# EAGLE design RdL_main_v04 (EAGLE 7.6.0)
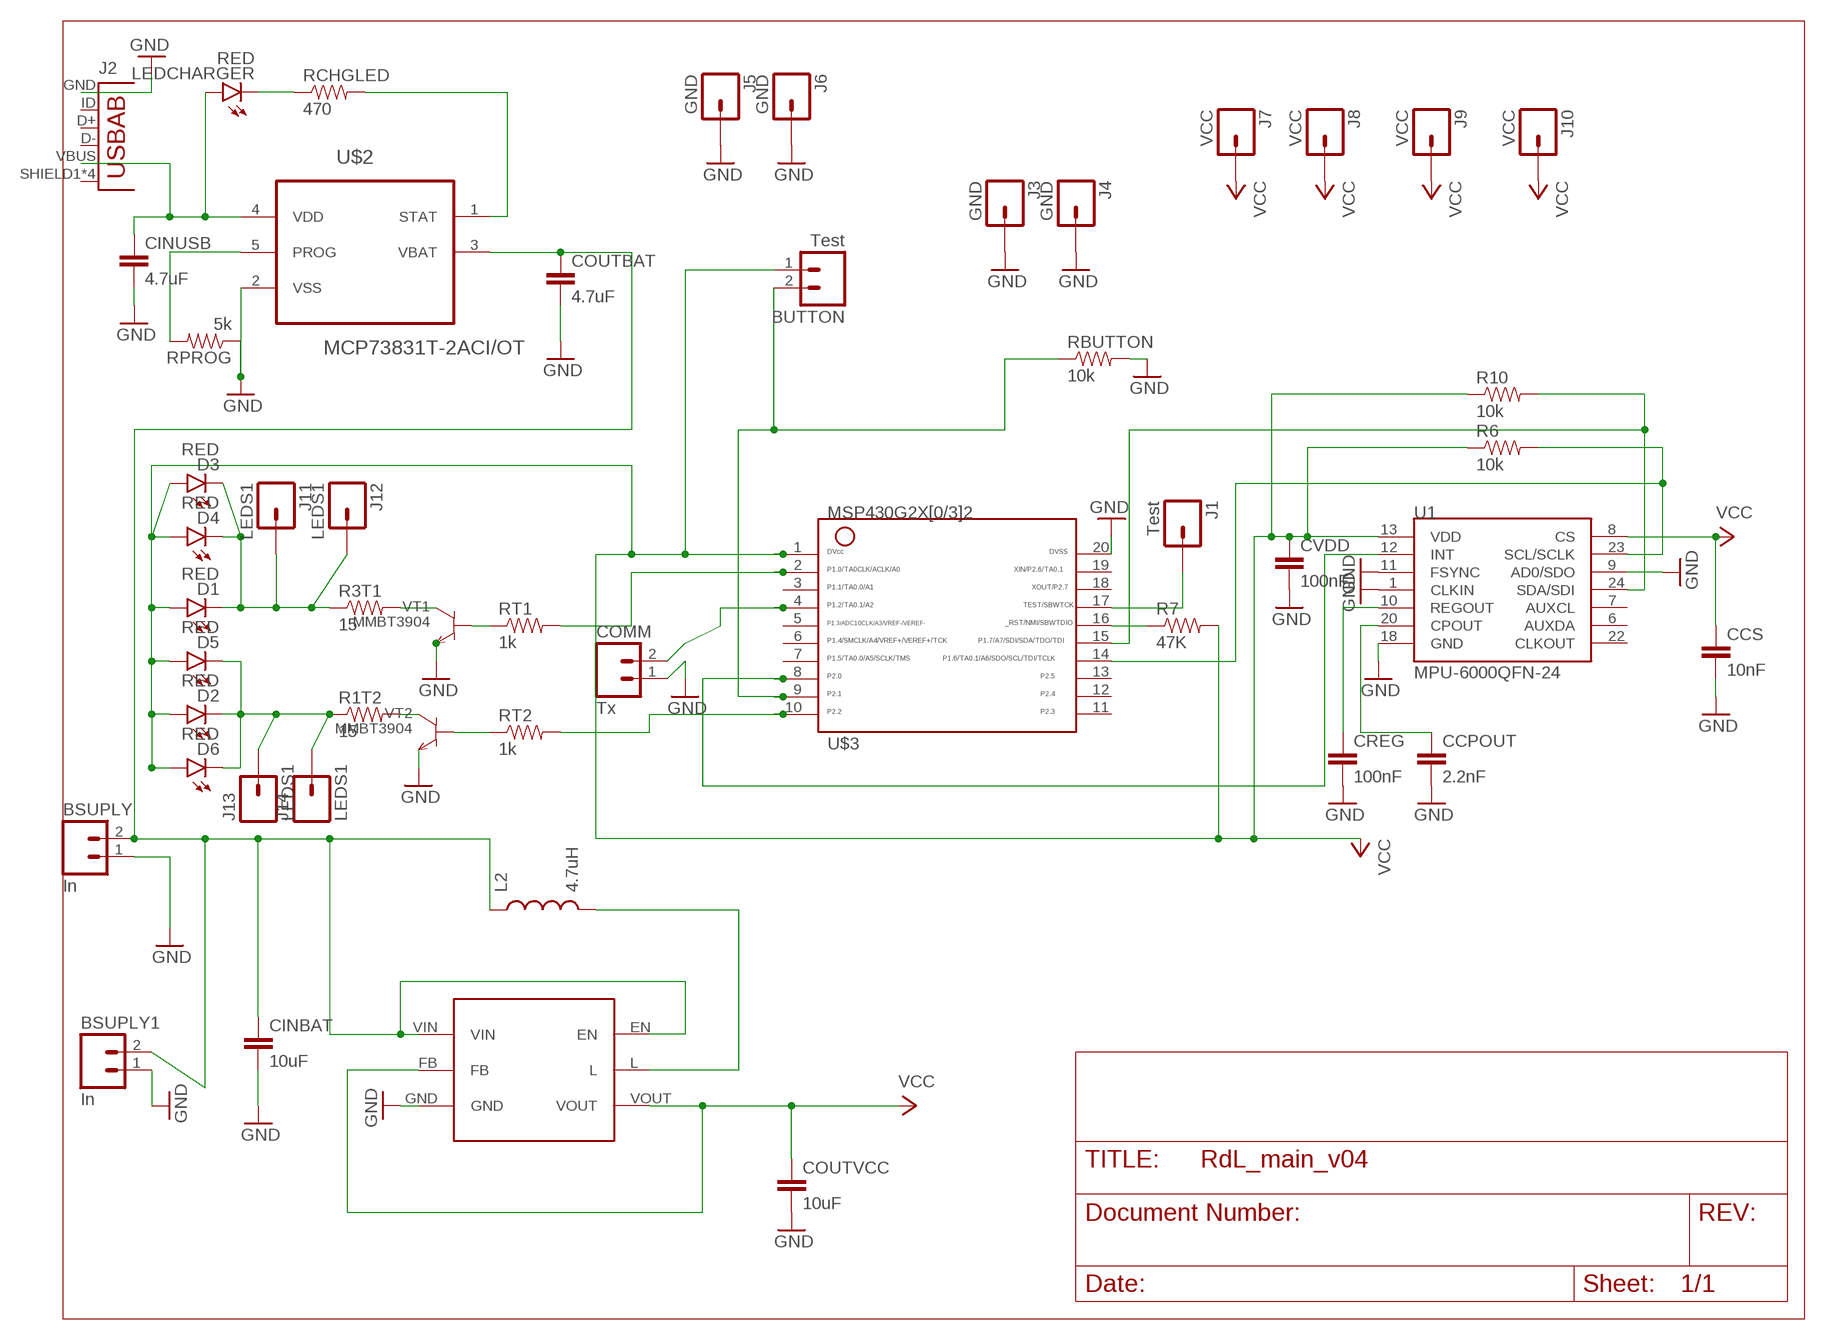
[diagram p0: schematic, sheet 1]

## Parts
BSUPLY  In  M02PTH  [1X02]
BSUPLY1  In  M02PTH  [1X02]
BUTTON  Test  M02PTH  [1X02]
CCPOUT  2.2nF  CAP0805  [0805]
CCS  10nF  CAP0805  [0805]
CINBAT  10uF  CAP0805  [0805]
CINUSB  4.7uF  CAP0805  [0805]
COMM  Tx  M02PTH  [1X02]
COUTBAT  4.7uF  CAP0805  [0805]
COUTVCC  10uF  CAP0805  [0805]
CREG  100nF  CAP0805  [0805]
CVDD  100nF  CAP0805  [0805]
D1  RED  LED-RED1206  [LED-1206]
D2  RED  LED-RED1206  [LED-1206]
D3  RED  LED-RED1206  [LED-1206]
D4  RED  LED-RED1206  [LED-1206]
D5  RED  LED-RED1206  [LED-1206]
D6  RED  LED-RED1206  [LED-1206]
J1  Test  M01PTH  [1X01]
J2  USB-AB  [USB-AB-MICRO-SMD]
J3  GND  M01PTH  [1X01]
J4  GND  M01PTH  [1X01]
J5  GND  M01PTH  [1X01]
J6  GND  M01PTH  [1X01]
J7  VCC  M01PTH  [1X01]
J8  VCC  M01PTH  [1X01]
J9  VCC  M01PTH  [1X01]
J10  VCC  M01PTH  [1X01]
J11  LEDS1  M01PTH  [1X01]
J12  LEDS1  M01PTH  [1X01]
J13  LEDS1  M01PTH  [1X01]
J14  LEDS1  M01PTH  [1X01]
L2  4.7uH  INDUCTORINDUCTOR_4.7UH  [INDUCTOR_4.7UH]
LEDCHARGER  RED  LED-RED1206  [LED-1206]
R1T2  15  RESISTOR1206  [1206]
R3T1  15  RESISTOR1206  [1206]
R6  10k  RESISTOR0805-RES  [0805]
R7  47K  47KOHM1/10W1%(0603)  [0603-RES]
R10  10k  RESISTOR0805-RES  [0805]
RBUTTON  10k  RESISTOR0805-RES  [0805]
RCHGLED  470  RESISTOR1206  [1206]
RPROG  5k  RESISTOR1206  [1206]
RT1  1k  RESISTOR1206  [1206]
RT2  1k  RESISTOR1206  [1206]
U1  MPU-6000QFN-24  [QFN-24-TESTING]
U$1  TLV61225  [TLV61225DCKT]
U$2  MCP73831T-2ACI/OT  [SOT95P280X145-5N]
U$3  G2X[0/3]2---PW20  [PW20]
VT1  MMBT3904  [SOT23-BEC]
VT2  MMBT3904  [SOT23-BEC]

## Nets
GND: BSUPLY1.1 BSUPLY.1 CCPOUT.2 CCS.2 CINBAT.2 CINUSB.2 COMM.1 COUTBAT.2 COUTVCC.2 CREG.2 CVDD.2 J2.GND J3.1 J4.1 J5.1 J6.1 RBUTTON.2 RPROG.1 U1.1(CLKIN) U1.9(AD0/SDO) U1.11(FSYNC) U1.18(GND) U$1.GND U$2.2(VSS) U$3.20 VT1.E VT2.E
N$1: BUTTON.2 RBUTTON.1 U$3.9
N$3: L2.P$2 U$1.L
N$4: J1.1 U$3.17
N$5: CINUSB.1 J2.VBUS LEDCHARGER.A U$2.4(VDD)
N$6: R1T2.2 VT2.C
N$7: R3T1.2 VT1.C
N$8: RT1.1 VT1.B
N$9: RT2.1 VT2.B
N$10: RT1.2 U$3.2
N$11: RT2.2 U$3.10
N$12: R7.1 U$3.16
N$13: D2.C D5.C D6.C J13.1 J14.1 R1T2.1
N$14: D1.C D3.C D4.C J11.1 J12.1 R3T1.1
N$15: COMM.2 U$3.4
N$16: LEDCHARGER.C RCHGLED.1
N$18: U1.12(INT) U$3.8
N$19: RPROG.2 U$2.5(PROG)
N$20: R10.2 U1.24(SDA/SDI) U$3.15
N$22: R6.2 U1.23(SCL/SCLK) U$3.14
N$23: CREG.1 U1.10(REGOUT)
N$26: CCPOUT.1 U1.20(CPOUT)
VCC: BUTTON.1 CCS.1 COUTVCC.1 CVDD.1 D1.A D2.A D3.A D4.A D5.A D6.A J7.1 J8.1 J9.1 J10.1 R6.1 R7.2 R10.1 U1.8(CS) U1.13(VDD) U$1.FB U$1.VOUT U$3.1
VINUSB: RCHGLED.2 U$2.1(STAT)
VOUTBATT: BSUPLY1.2 BSUPLY.2 CINBAT.1 COUTBAT.1 L2.P$1 U$1.EN U$1.VIN U$2.3(VBAT)
Unconnected: J2.D+ J2.D- J2.ID(USBID) J2.SHIELD1(SHIELD) J2.SHIELD2(SHIELD) J2.SHIELD3(SHIELD) J2.SHIELD4(SHIELD) U1.6(AUXDA) U1.7(AUXCL) U1.22(CLKOUT) U$3.3 U$3.5 U$3.6 U$3.7 U$3.11 U$3.12 U$3.13 U$3.18 U$3.19

## Library data of the parts
BSUPLY BSUPLY1 BUTTON COMM = SparkFun-Connectors:M02: Standard 2-pin 0.1" header. Use with - straight break away headers ( PRT-00116) - right angle break away headers (PRT-00553) - swiss pins (PRT-00743) - machine pins (PRT-00117) - female headers (PRT-00115) Molex polarized connector foot print use with: PRT-08233 with associated crimp pins and housings. 2.54_SCREWTERM for use with PRT-10571. 3.5mm Screw Terminal footprints for PRT-08084 5mm Screw Terminal footprints for use with PRT-08432
CCPOUT CCS CINBAT CINUSB COUTBAT COUTVCC CREG CVDD = SparkFun-Capacitors:CAP: Capacitor Standard 0603 ceramic capacitor, and 0.1" leaded capacitor.
D1-D6 LEDCHARGER = SparkFun-LED:LED-RED: Assorted Red LEDs LilyPad 1206- DIO-09912 1206- DIO-00809 0603- DIO-00819 "SMART" means more efficient and expensive; PROD_ID: DIO-09912
J1 J3-J14 = SparkFun-Connectors:M01: Header 1 Standard 1-pin 0.1" header. Use with straight break away headers (SKU : PRT-00116), right angle break away headers (PRT-00553), swiss pins (PRT-00743), machine pins (PRT-00117), and female headers (PRT-00115). SMTSO-256-ET is a "flush mount" nut for a 4-40 screw. The older package used to be too tight, and did not allow it to sit properly thru the drill hit. The latest (0.165DIA) fits nice and snug.
J2 = SparkFun-Connectors:USB-AB: This is a USB AB connector that is compatible with USB OTG. i.e. this connector can serve as a host or device
L2 = SparkFun-Passives:INDUCTOR: Inductors Basic Inductor/Choke - 0603 and 1206. Footprints are not proven and vary greatly between part numbers. INDUCTOR POWER 3.3UH 4.0A SMD 0.197" L x 0.197" W x 0.177" H (5.00mm x 5.00mm x 4.50mm); PROD_ID: NDUC-10146
R1T2 R3T1 R6 R10 RBUTTON RCHGLED RPROG RT1 RT2 = SparkFun-Resistors:RESISTOR: Resistor Basic schematic elements and footprints for 0603, 1206, and PTH resistors.
R7 = SparkFun-Resistors:47KOHM1/10W1%(0603): RES-07871; PROD_ID: RES-07871
U1 = SparkFun-Sensors:MPU-6000: MPU-6000 - I2C address is 0x68 with AD0 low and 0x69 with AD0 high.
U$1 = TLV61225DCKT:TLV61225: TLV61225 Single-Cell High-Efficient Step-up Converter
U$2 = MCP73831T-2ACI_OT:MCP73831T-2ACI/OT: Charge Management Controller; MPN: MCP73831T-2ACI/OT; OC_FARNELL: 1332158; OC_NEWARK: 56K7045; PACKAGE: SOT-5; SUPPLIER: Microchip
U$3 = TI_MSP430_v16:G2X[0/3]2---PW20: MSP430G2X[0/3]2 MSP430G2x32, MSP430G2x02 TSSOP (PW) 20 Pin Package http://focus.ti.com/docs/prod/folders/print/msp430g2432.html
VT1 VT2 = transistor-npn:MMBT3904*: NPN TRANSISTOR

## Net classes
0 default: clearance 0.205 mm

## Board
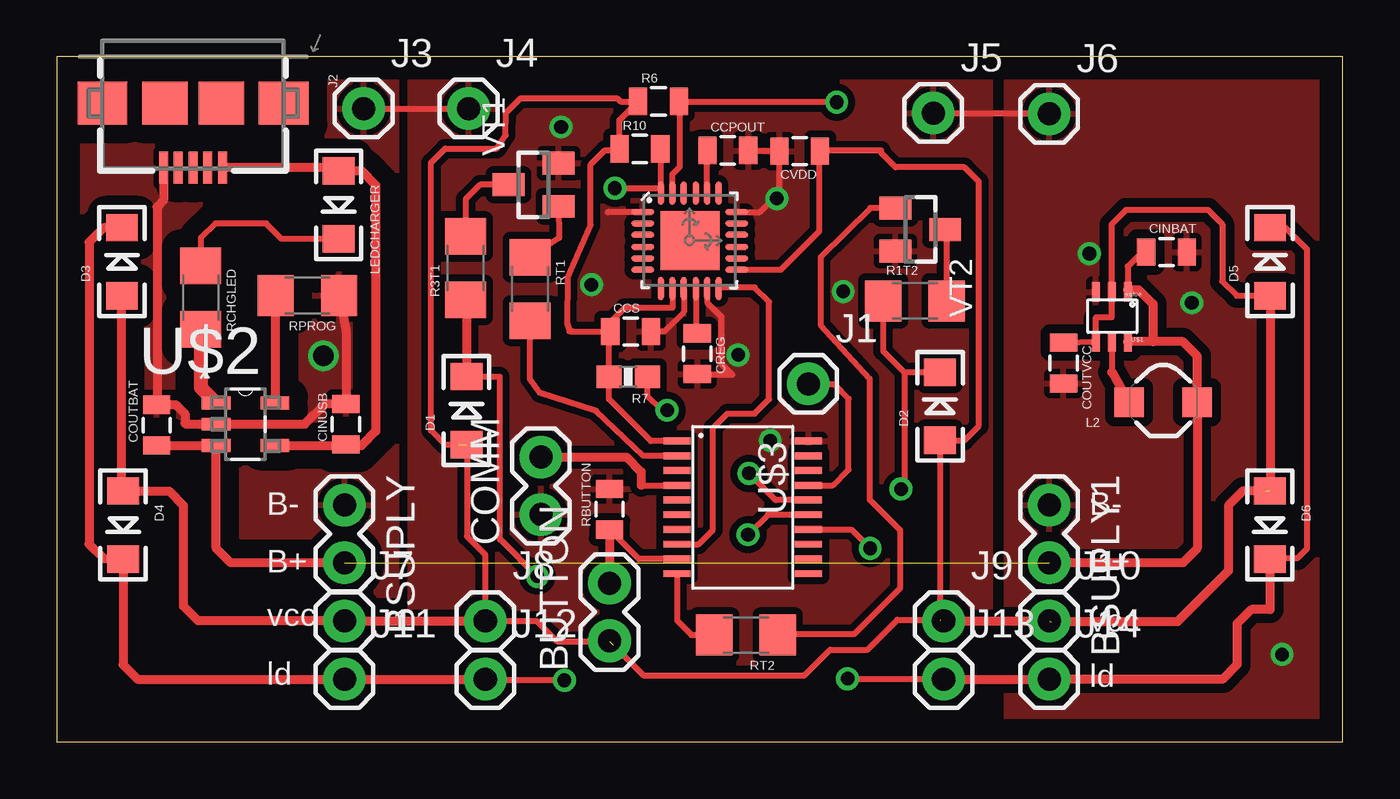
[diagram p1: board, top side]
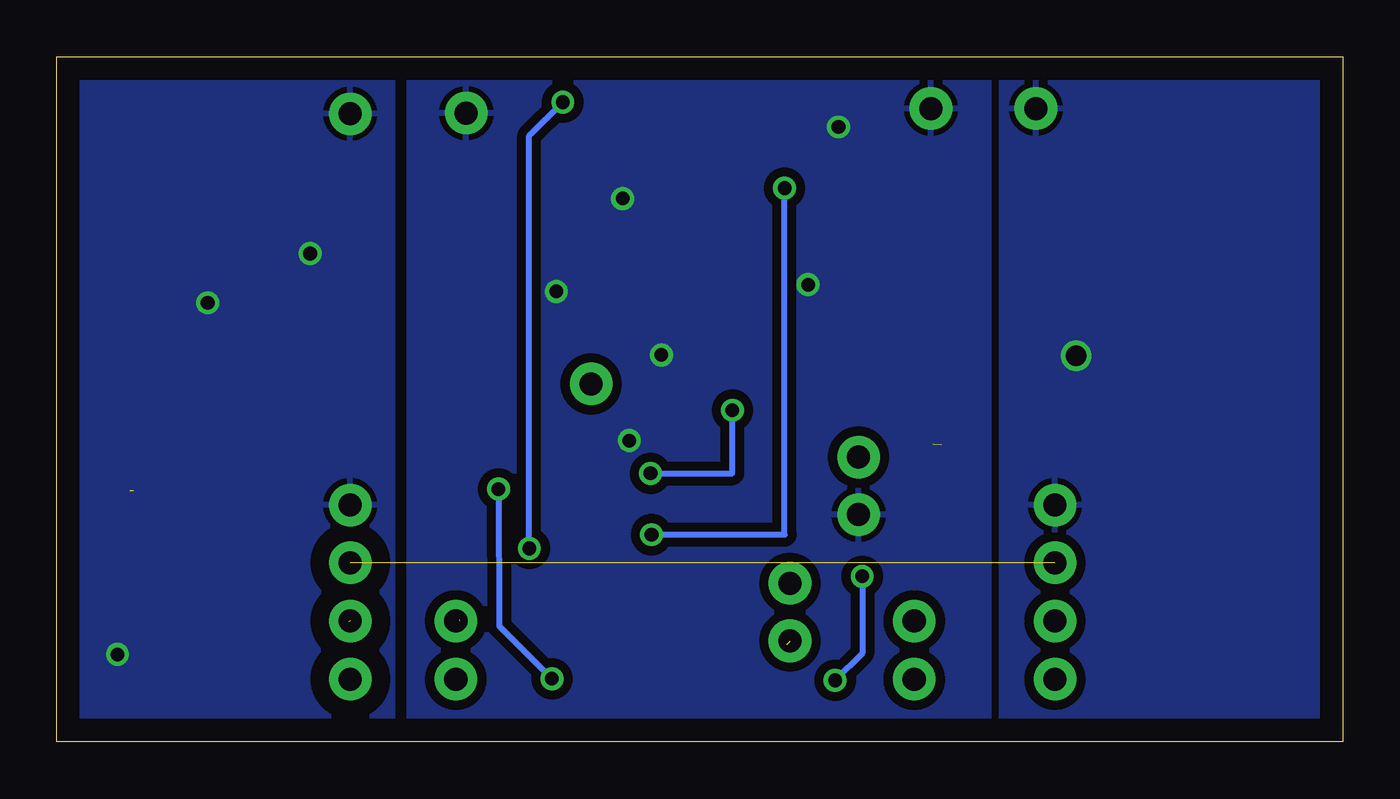
[diagram p2: board, bottom side, seen from below]

Size 56.74 x 30.24 mm. Coordinates in mm from the lower left corner, seen from the top.
Outline: 0,0 56.74,0 56.74,30.24 0,30.24 0,0
Copper layers (1*16): Top 0.035mm / dielectric 1.5mm / Bottom 0.035mm
Design rules "default": minimum track width 10mil, minimum drill 24mil, track to track 8mil, track to pad 8mil, pad to pad 8mil, via to via 8mil, smd to smd 8mil, copper to edge 40mil, drill to drill 8mil, minimum pad ring 10mil, minimum via ring 8mil, stop-mask expansion 4mil, vias tented up to drill 0mil, thermal gap 10mil

### Footprints (pad centres in the part's own frame; a part is rotated, then mirrored left to right if it is on the bottom)
1X02 = drill 1.016 pad 1.88: 1 0,0; 2 2.54,0
0805 = smd 0.8 x 1.2: 1 -0.9,0; 2 0.9,0
LED-1206 = smd 1.2 x 1.4: A -1.5,0; C 1.5,0
1X01 = drill 1.016 pad 1.88: 1 0,0
USB-AB-MICRO-SMD = smd 1.4 x 0.4: D+ 2.85,0; D- 2.85,0.65; GND 2.85,-1.3; ID 2.85,-0.65; VBUS 2.85,1.3 | smd 1.9 x 2.2: SHIELD1 0,4; SHIELD4 0,-4 | smd 1.9 x 2: SHIELD2 0,1.25; SHIELD3 0,-1.25
INDUCTOR_4.7UH = smd 1.3 x 1.3: P$1 -1.5,0; P$2 1.5,0
1206 = smd 1.6 x 1.8: 1 -1.4,0; 2 1.4,0
0603-RES = smd 1.1 x 1: 1 -0.85,0; 2 0.85,0
QFN-24-TESTING = smd 1.016 x 0.254: 1 -2.066,1.257; 2 -2.066,0.75; 3 -2.066,0.247; 4 -2.066,-0.287; 5 -2.066,-0.792; 6 -2.066,-1.297; 13 2.086,-1.297; 14 2.086,-0.792; 15 2.086,-0.287; 16 2.086,0.247; 17 2.086,0.75; 18 2.086,1.257 | smd 0.254 x 1.016: 7 -1.267,-2.122; 8 -0.762,-2.122; 9 -0.258,-2.122; 10 0.278,-2.122; 11 0.78,-2.122; 12 1.287,-2.122; 19 1.287,2.082; 20 0.78,2.082; 21 0.278,2.082; 22 -0.258,2.082; 23 -0.762,2.082; 24 -1.267,2.082 | smd 2.616 x 2.616: P$1 0.02,-0.01
TLV61225DCKT = smd 0.35 x 0.85: EN -3,2.2; FB -2.3,0; GND -1.6,0; L -2.3,2.2; VIN -3,0; VOUT -1.6,2.2
SOT95P280X145-5N = smd 1.27 x 0.559: 1 -1.295,0.94; 2 -1.295,0; 3 -1.295,-0.94; 4 1.295,-0.94; 5 1.295,0.94
PW20 = smd 0.3 x 1.2: 1 -2.925,-2.9; 2 -2.275,-2.9; 3 -1.625,-2.9; 4 -0.975,-2.9; 5 -0.325,-2.9; 6 0.325,-2.9; 7 0.975,-2.9; 8 1.625,-2.9; 9 2.275,-2.9; 10 2.925,-2.9; 11 2.925,2.9; 12 2.275,2.9; 13 1.625,2.9; 14 0.975,2.9; 15 0.325,2.9; 16 -0.325,2.9; 17 -0.975,2.9; 18 -1.625,2.9; 19 -2.275,2.9; 20 -2.925,2.9
SOT23-BEC = smd 1 x 1.4: B -0.95,-1.1; C 0,1.1; E 0.95,-1.1

### Placement (x,y rotation side)
BSUPLY  12.7,10.45 270 top
BSUPLY1  43.79,10.45 270 top
BUTTON  24.39,4.46 90 top
CCPOUT  29.61,26.1 0 top
CCS  25.32,18.11 0 top
CINBAT  48.96,21.62 0 top
CINUSB  12.76,14.02 90 top
COMM  21.36,10.03 90 top
COUTBAT  4.41,13.98 90 top
COUTVCC  44.42,16.72 270 top
CREG  28.26,17.13 270 top
CVDD  32.78,26.07 180 top
D1  18.08,14.62 90 top
D2  38.97,14.81 90 top
D3  2.88,21.19 90 top
D4  2.93,9.57 270 top
D5  53.53,21.19 90 top
D6  53.52,9.57 270 top
J1  33.16,15.8 0 top
J2  6.02,28.19 270 top
J3  13.54,27.95 0 top
J4  18.17,27.95 0 top
J5  38.67,27.75 0 top
J6  43.79,27.72 0 top
J7  12.7,5.34 0 top
J8  18.91,5.34 0 top
J9  39.13,5.34 0 top
J10  43.79,5.34 0 top
J11  12.7,2.77 0 top
J12  18.91,2.77 0 top
J13  39.13,2.77 0 top
J14  43.79,2.77 0 top
L2  48.82,15 180 top
LEDCHARGER  12.44,23.7 270 top
R1T2  37.86,19.46 0 top
R3T1  18.04,20.91 90 top
R6  26.55,28.26 0 top
R7  25.21,16.12 180 top
R10  25.73,26.17 0 top
RBUTTON  24.39,10.27 90 top
RCHGLED  6.36,19.61 270 top
RPROG  11.06,19.7 180 top
RT1  20.88,19.99 270 top
RT2  30.41,4.72 180 top
U1  27.92,22.13 0 top
U$1  44.25,19.86 180 top
U$2  8.33,14.02 0 top
U$3  30.27,10.35 270 top
VT1  21.04,24.59 90 top
VT2  38.1,22.61 270 top

### Tracks (layer width: path | path; a pad name or v marks a point on that pad's centre or on a via)
GND  (via drill 0.6, 0.9)
  Top 0.254: J3.1 J4.1 | J5.1 43.79,27.75 J6.1 | U1.18 31.02,23.39 31.89,24.26 CVDD.2 31.85,26.1 CCPOUT.2 | U1.9 27.67,18.98 26.8,18.11 CCS.2 | U1.11 28.7,19.39 29.31,18.78 29.31,16.7 29.81,16.2 28.29,16.2 CREG.2 | U1.1 24.34,23.39 24.31,23.36
  Top 0.406: RPROG.1 12.76,18.12 CINUSB.2 11.86,14.93 10.95,14.02 U$2.2 7.01,14.04 5.68,14.04 5.66,14.06 5.66,14.47 5.25,14.88 COUTBAT.2 4.43,14.9 4.43,23.61 4.72,23.9 J2.GND
  other vias: 11.77,17.04 54.06,3.86 30.06,17.08 31.48,13.3 31.77,23.98 50.08,19.38 45.56,21.55 34.7,19.88 22.25,27.14 23.59,20.18
  pour Top (isolate 0.813): 0.29,30.06 14.97,30.06 14.97,0.04 0.29,0.04
  pour Bottom (isolate 0.406): 0.19,30.21 15.07,30.21 15.07,0.09 0.19,0.09
  pour Top (isolate 0.406): 41.93,29.73 56.36,29.73 56.36,0.34 41.93,0.34
  pour Bottom (isolate 0.813): 41.93,29.7 56.36,29.7 56.36,0.3 41.93,0.3
  pour Top (isolate 0.305): 15.61,30.32 41.16,30.19 41.16,0.04 15.61,0.17
  pour Bottom (isolate 0.406): 15.61,30.27 41.2,30.19 41.2,0 15.61,0.08
N$1
  Top 0.254: U$3.9 25.68,8.07 RBUTTON.1
  Top 0.406: RBUTTON.1 BUTTON.2
N$3
  Top 0.254: U$1.L 46.55,16.32 | 47.23,15.1 L2.P$2
  Top 0.406: 46.55,16.32 47.23,15.1
N$4
  Top 0.254: U$3.17 34.24,11.32 34.94,12.02 34.94,15.13 34.3,15.77 33.19,15.77 J1.1
N$5
  Top 0.406: J2.VBUS 12.44,25.34 LEDCHARGER.A 13.45,25.2 14.08,24.57 14.08,13.71 13.45,13.08 12.76,13.08 CINUSB.1 12.72,13.08 U$2.4
N$6
  Top 0.254: VT2.C 39.26,22.61 R1T2.2
N$7
  Top 0.254: VT1.C 18.68,24.59 18.04,23.95 R3T1.2
N$8
  Top 0.254: VT1.B 22.17,22.24 RT1.1
N$9
  Top 0.254: VT2.B 35.89,23.56 33.7,21.39 33.7,18.4 35.86,16.03 35.86,10.7 37.21,9.35 37.21,6.78 35.18,4.75 31.84,4.75 RT2.1
N$10
  Top 0.254: U$3.2 25.89,12.62 23.8,14.61 21.32,15.41 20.88,16.01 RT1.2
N$11
  Top 0.254: U$3.10 27.37,5.36 28,4.72 RT2.2
N$12  (via drill 0.6)
  Top 0.254: U$3.16 31.71,10.68 v30.54,11.85 | v26.93,14.64 26.7,14.64 26.06,15.28 R7.1
  Bottom 0.254: v30.54,11.85 26.93,11.85 v26.93,14.64
N$13  (via drill 0.6)
  Top 0.254: D5.C 54.21,22.69 55.16,21.74 55.16,8.52 54.74,8.1 53.55,8.1 D6.C | D2.C 37.4,16.31 | 37.4,16.31 37.4,11.24 v37.25,11.16 | v34.89,2.79 39.11,2.79 J13.1 | R1T2.1 36.46,17.25 37.4,16.31
  Top 0.406: J13.1 J14.1 51.44,2.77 52.07,3.4 52.07,5.21 52.7,5.85 53.52,5.85 D6.C
  Bottom 0.254: v37.25,11.16 37.22,5.12 v34.89,2.79
N$14  (via drill 0.6)
  Top 0.254: D1.C 19.54,16.12 19.54,8.93 19.58,8.93 v21.2,7.31 | v22.4,2.72 18.96,2.72 J12.1
  Top 0.406: R3T1.1 18.08,19.51 D1.C | D3.C 2.06,22.69 1.43,22.05 1.43,8.72 2.06,8.09 2.93,8.09 D4.C 2.93,3.4 3.56,2.77 J11.1 J12.1
  Bottom 0.254: v21.2,7.31 21.2,3.92 v22.4,2.72
N$15
  Top 0.254: 25.78,11.32 U$3.4
  Top 0.406: COMM.2 25.13,12.57 25.78,11.92 25.78,11.32
N$16
  Top 0.254: LEDCHARGER.C 9.93,22.2 9.25,22.88 7,22.88 6.36,22.25 RCHGLED.1
N$18
  Top 0.254: U$3.8 28.32,8.72 28.95,9.36 28.95,13.86 29.59,14.49 30.8,14.49 31.43,15.12 31.43,19.43 30.8,20.06 29.21,20.06 U1.12
N$19
  Top 0.406: U$2.5 9.66,14.96 RPROG.2
N$20  (via drill 0.6)
  Top 0.254: R10.2 26.65,26.15 U1.24 26.65,24.44 v24.63,24.44 | U$3.15 31.38,10.03 v30.5,9.15
  Bottom 0.254: v30.5,9.15 24.63,9.15 v24.63,24.44
N$22  (via drill 0.6)
  Top 0.254: U1.23 27.16,25.05 27.49,25.38 27.49,28.22 R6.2 27.48,28.23 v34.41,28.23 | U$3.14 35.05,9.38 v35.89,8.54
  Bottom 0.254: v35.89,8.54 35.89,26.75 v34.41,28.23
N$23
  Top 0.254: U1.10 28.2,18.03 CREG.1
N$26
  Top 0.254: U1.20 CCPOUT.1
VCC  (5 unrouted)
  Top 0.254: COUTVCC.1 U$1.VOUT 45.85,18.74 46.55,18.74 U$1.FB 46.55,22.84 47.19,23.48 50.78,23.48 51.42,22.84 51.42,20.32 52.05,19.69 D5.A | U$3.1 26.21,13.28 24.36,15.13 R7.2 24.36,18.05 CCS.1 | U1.13 31.94,20.83 33.65,22.54 33.65,26.04 CVDD.1 33.68,26.1 36.37,26.1 36.37,26 37.01,25.36 40.05,25.36 40.68,24.73 40.68,13.95 40.05,13.31 D2.A 38.97,5.34 J9.1 | D6.A | BUTTON.1 24.39,4.44 22.07,4.44 21.8,4.71 21.16,5.34 J8.1 18.91,8.27 18.73,8.44 18.1,9.07 18.1,13.12 D1.A | 24.55,4.28 25.9,2.93 32.98,2.93 34.12,4.07 35.77,4.07 37.09,5.39 38.99,5.39 | U1.8 27.16,19.15 25.05,19.15 24.41,18.52 CCS.1 | CCS.1 22.77,18.11 22.69,18.12 22.62,18.12 22.52,18.47 22.54,20.49 23.56,22.81 23.56,25.48 24.2,26.11 24.83,26.11 R10.1 24.83,27.44 R6.1 24.87,28.26 24.73,28.4 20.46,28.4 19.82,27.77 19.81,26.77 19.45,26.23 19.42,26.19 17.14,26.19 16.51,25.55 16.51,13.73 17.14,13.1 17.7,13.1
  Top 0.406: D5.A D6.A | D3.A 2.88,11.07 D4.A 4.96,11.07 5.59,10.44 5.59,6 6.22,5.36 12.7,5.36 J7.1 J8.1 | J9.1 J10.1 | 53.34,11.07 52.33,11.07 51.69,10.44 51.69,7.55 49.44,5.3 43.86,5.3
VINUSB
  Top 0.61: RCHGLED.2 6.36,15.63 U$2.1
VOUTBATT  (1 unrouted)
  Top 0.254: U$1.VIN 47.25,19.96 | U$1.VIN | CINBAT.1 47.88,21.62 47.25,20.98 U$1.VIN
  Top 0.406: COUTBAT.1 U$2.3 7.04,8.54 7.68,7.9 BSUPLY.2 | 47.25,19.96 47.73,19.96 48.36,19.32 48.36,17.66 | 48.36,17.66 U$1.EN | 48.36,17.66 49.69,17.66 50.32,17.02 L2.P$1 50.32,8.54 49.69,7.91 BSUPLY1.2

### Text on the board
tPlace: B- | B- | B+ | B+ | vcc | vcc | ld | ld